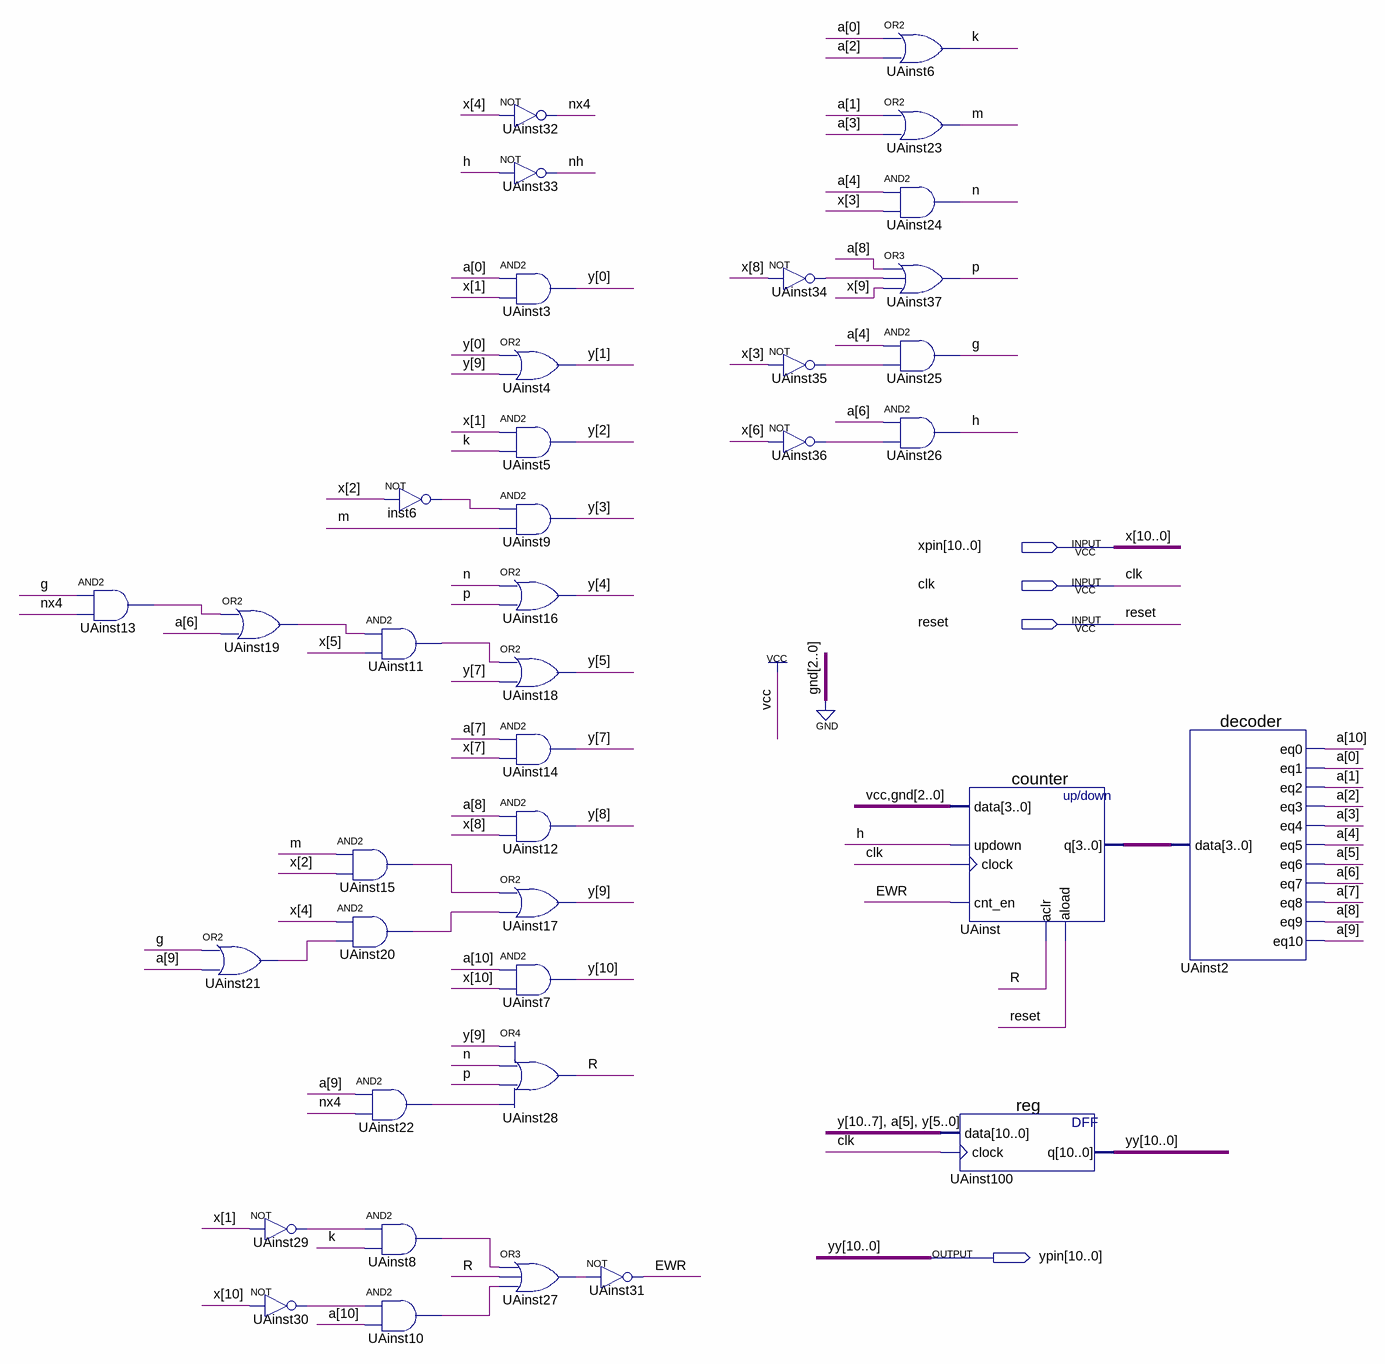
[diagram p0: schematic sheet]
// Quartus schematic lab2.bdf as structural Verilog: 39 symbols, 4 pins
module lab2 (
  input  [10:0] xpin,
  input  clk,
  input  reset,
  output [10:0] ypin
);

  wire EWR, g, h, inst6_out, k, m, n, nh, nx4, p, R, UAinst8_out, UAinst10_out, UAinst11_out, UAinst13_out,
       UAinst15_out, UAinst19_out, UAinst20_out, UAinst21_out, UAinst22_out, UAinst27_out, UAinst29_out,
       UAinst30_out, UAinst34_out, UAinst35_out, UAinst36_out;
  wire [3:0] UAinst_q;
  wire [10:0] a, y;

  and UAinst13 (UAinst13_out, g, nx4);
  or UAinst21 (UAinst21_out, g, a[9]);
  or UAinst19 (UAinst19_out, UAinst13_out, a[6]);
  not UAinst29 (UAinst29_out, xpin[1]);
  not UAinst30 (UAinst30_out, xpin[10]);
  and UAinst11 (UAinst11_out, UAinst19_out, xpin[5]);
  and UAinst15 (UAinst15_out, m, xpin[2]);
  and UAinst20 (UAinst20_out, xpin[4], UAinst21_out);
  and UAinst22 (UAinst22_out, a[9], nx4);
  and UAinst8 (UAinst8_out, UAinst29_out, k);
  and UAinst10 (UAinst10_out, UAinst30_out, a[10]);
  not inst6 (inst6_out, xpin[2]);
  not UAinst32 (nx4, xpin[4]);
  not UAinst33 (nh, h);
  and UAinst3 (y[0], a[0], xpin[1]);
  or UAinst4 (y[1], y[0], y[9]);
  and UAinst5 (y[2], xpin[1], k);
  and UAinst9 (y[3], inst6_out, m);
  or UAinst16 (y[4], n, p);
  or UAinst18 (y[5], UAinst11_out, y[7]);
  and UAinst14 (y[7], a[7], xpin[7]);
  and UAinst12 (y[8], a[8], xpin[8]);
  or UAinst17 (y[9], UAinst15_out, UAinst20_out);
  and UAinst7 (y[10], a[10], xpin[10]);
  or UAinst28 (R, y[9], n, p, UAinst22_out);
  or UAinst27 (UAinst27_out, UAinst8_out, R, UAinst10_out);
  not UAinst31 (EWR, UAinst27_out);
  not UAinst34 (UAinst34_out, xpin[8]);
  not UAinst35 (UAinst35_out, xpin[3]);
  not UAinst36 (UAinst36_out, xpin[6]);
  or UAinst6 (k, a[0], a[2]);
  or UAinst23 (m, a[1], a[3]);
  and UAinst24 (n, a[4], xpin[3]);
  or UAinst37 (p, a[8], UAinst34_out, xpin[9]);
  and UAinst25 (g, a[4], UAinst35_out);
  and UAinst26 (h, a[6], UAinst36_out);
  counter UAinst (.data(4'b1000), .updown(h), .clock(clk), .cnt_en(EWR), .aclr(R), .aload(reset), .q(UAinst_q));
  \reg  UAinst100 (.data({y[10:7], a[5], y[5:0]}), .clock(clk), .q(ypin));
  decoder UAinst2 (
    .data(UAinst_q), .eq0(a[10]), .eq1(a[0]), .eq2(a[1]), .eq3(a[2]), .eq4(a[3]), .eq5(a[4]), .eq6(a[5]),
    .eq7(a[6]), .eq8(a[7]), .eq9(a[8]), .eq10(a[9]));

  // Other names for the same wires on the sheet: x[10:0] = xpin; yy[10:0] = ypin
endmodule
